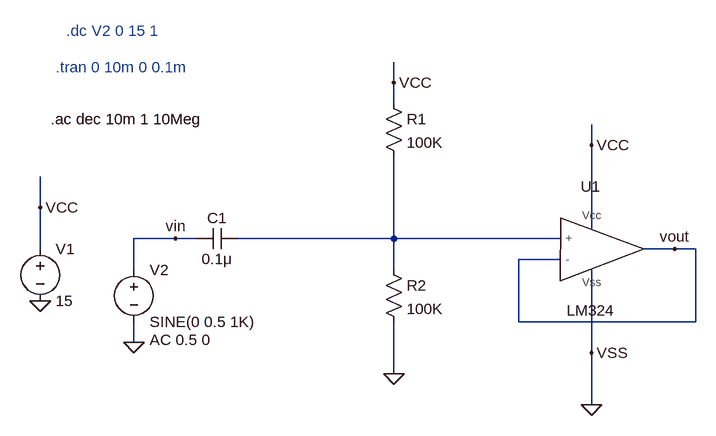
[diagram p0: schematic BAI 2 CHUAN BI 2.asc]
BAI 2 CHUAN BI 2.asc, the LTspice schematic file:
Version 4.1
SHEET 1 880 680
WIRE -64 -96 -64 -128
WIRE -64 -64 -64 -96
WIRE 240 0 240 -32
WIRE -608 96 -608 48
WIRE 240 128 240 0
WIRE -400 144 -464 144
WIRE -368 144 -400 144
WIRE -64 144 -64 16
WIRE -64 144 -304 144
WIRE 192 144 -64 144
WIRE -608 160 -608 96
WIRE 368 160 320 160
WIRE 400 160 368 160
WIRE 192 176 128 176
WIRE -464 192 -464 144
WIRE -64 192 -64 144
WIRE 128 272 128 176
WIRE 400 272 400 160
WIRE 400 272 128 272
WIRE -464 304 -464 272
WIRE 240 320 240 192
WIRE -64 352 -64 272
WIRE 240 400 240 320
FLAG 240 400 0
FLAG 240 0 VCC
FLAG 240 320 VSS
FLAG -64 352 0
FLAG -64 -96 VCC
FLAG -464 304 0
FLAG -608 96 VCC
FLAG -608 240 0
FLAG 368 160 vout
FLAG -400 144 vin
SYMBOL LM324 240 160 R0
SYMATTR InstName U1
SYMBOL res -80 176 R0
SYMATTR InstName R2
SYMATTR Value 100K
SYMBOL res -80 -80 R0
SYMATTR InstName R1
SYMATTR Value 100K
SYMBOL cap -304 128 R90
WINDOW 0 0 32 VBottom 2
WINDOW 3 32 32 VTop 2
SYMATTR InstName C1
SYMATTR Value 0.1μ
SYMBOL voltage -464 176 R0
WINDOW 123 24 124 Left 2
WINDOW 39 0 0 Left 0
SYMATTR Value2 AC 0.5 0
SYMATTR InstName V2
SYMATTR Value SINE(0 0.5 1K)
SYMBOL voltage -608 144 R0
WINDOW 123 0 0 Left 0
WINDOW 39 0 0 Left 0
SYMATTR InstName V1
SYMATTR Value 15
TEXT -584 -120 Left 2 ;.tran 0 10m 0 0.1m
TEXT -568 -176 Left 2 ;.dc V2 0 15 1
TEXT -592 -40 Left 2 !.ac dec 10m 1 10Meg

The netlist it stands for:
* BAI 2 CHUAN BI 2.asc
X§U1 N001 vout VCC 0 vout LM324  ; pins + - Vcc Vss ?
R2 N001 0 100K
R1 VCC N001 100K
C1 N001 vin 0.1μ
V2 vin 0 SINE(0 0.5 1K) AC 0.5 0
V1 VCC 0 15
* .tran 0 10m 0 0.1m
* .dc V2 0 15 1
.ac dec 10m 1 10Meg
.lib E:\ThiThucHanhCoHa\CoHa\LM324.cir
.backanno
.end